# EAGLE design IOExpander (EAGLE 9.5.2)

## Sheet 1 of 2
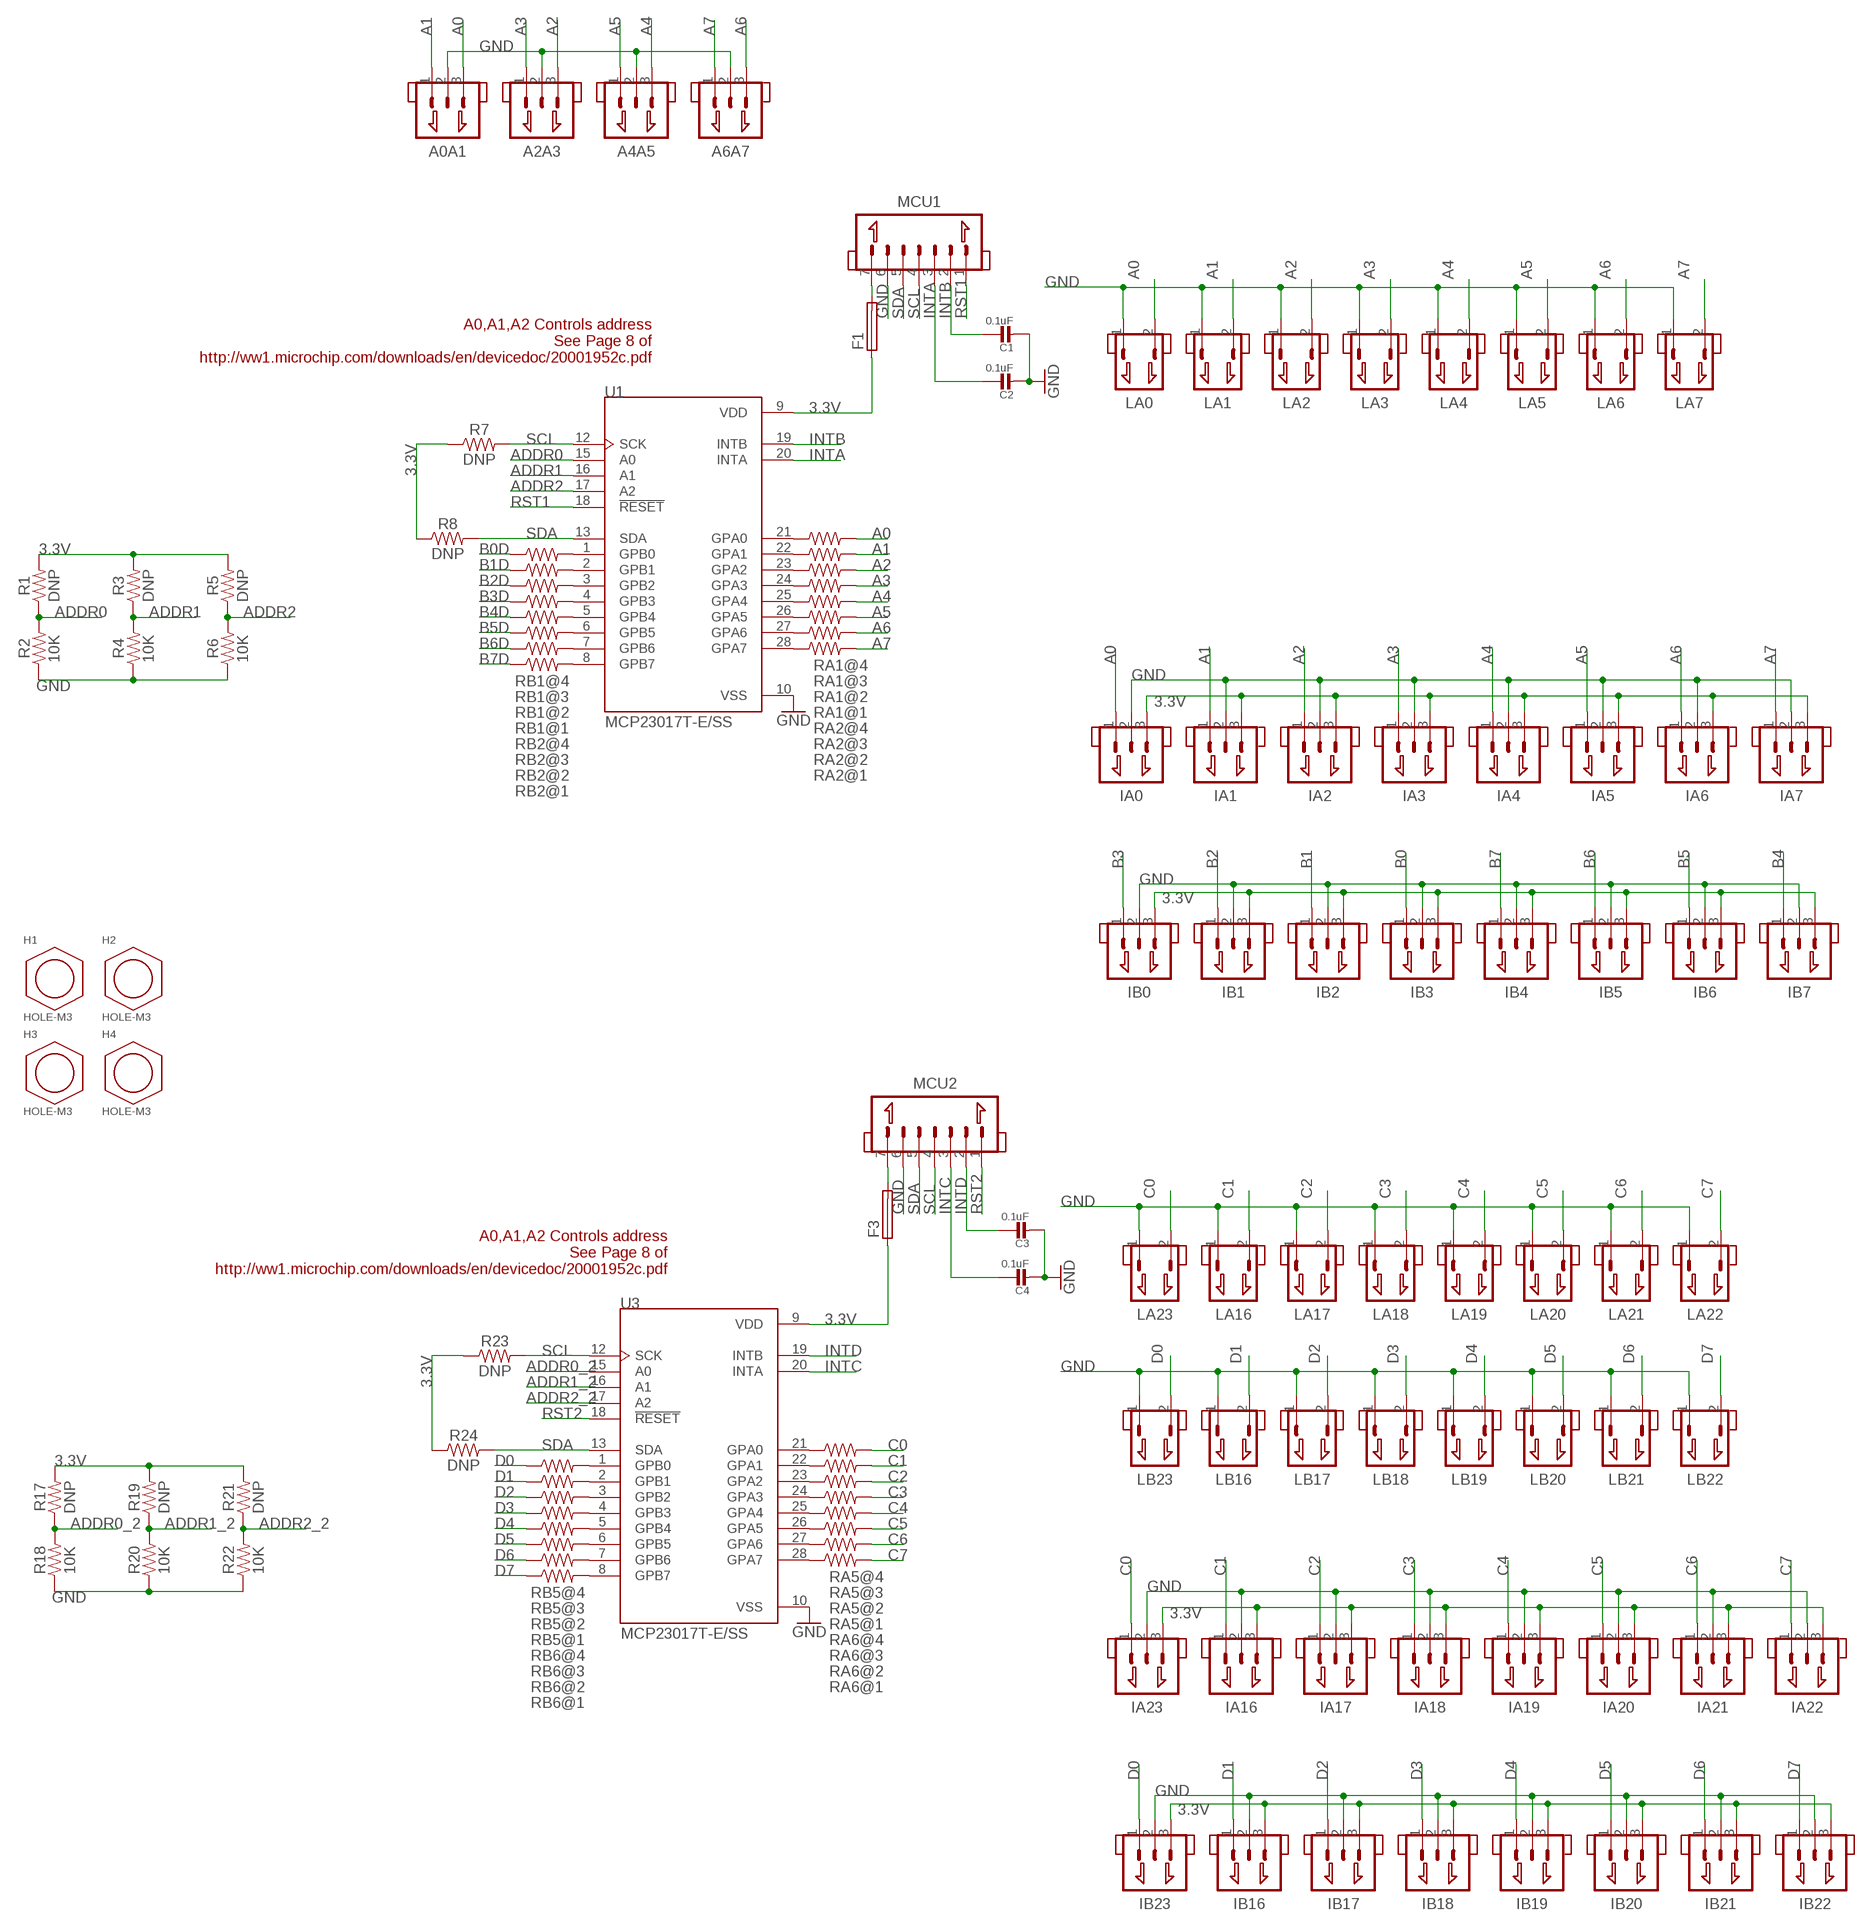
[diagram p0: schematic, sheet 1]

### Parts
A0A1  JST_1.25_3P  [JST1.25_3P]
A2A3  JST_1.25_3P  [JST1.25_3P]
A4A5  JST_1.25_3P  [JST1.25_3P]
A6A7  JST_1.25_3P  [JST1.25_3P]
C1  0.1uF  CAP_CERAMIC_0603  [0603]
C2  0.1uF  CAP_CERAMIC_0603  [0603]
C3  0.1uF  CAP_CERAMIC_0603  [0603]
C4  0.1uF  CAP_CERAMIC_0603  [0603]
F1  FUSE-0603  [0603]
F3  FUSE-0603  [0603]
H1  HOLE-M3  [M3]
H2  HOLE-M3  [M3]
H3  HOLE-M3  [M3]
H4  HOLE-M3  [M3]
IA0  JST_1.25_3P  [JST1.25_3P]
IA1  JST_1.25_3P  [JST1.25_3P]
IA2  JST_1.25_3P  [JST1.25_3P]
IA3  JST_1.25_3P  [JST1.25_3P]
IA4  JST_1.25_3P  [JST1.25_3P]
IA5  JST_1.25_3P  [JST1.25_3P]
IA6  JST_1.25_3P  [JST1.25_3P]
IA7  JST_1.25_3P  [JST1.25_3P]
IA16  JST_1.25_3P  [JST1.25_3P]
IA17  JST_1.25_3P  [JST1.25_3P]
IA18  JST_1.25_3P  [JST1.25_3P]
IA19  JST_1.25_3P  [JST1.25_3P]
IA20  JST_1.25_3P  [JST1.25_3P]
IA21  JST_1.25_3P  [JST1.25_3P]
IA22  JST_1.25_3P  [JST1.25_3P]
IA23  JST_1.25_3P  [JST1.25_3P]
IB0  JST_1.25_3P  [JST1.25_3P]
IB1  JST_1.25_3P  [JST1.25_3P]
IB2  JST_1.25_3P  [JST1.25_3P]
IB3  JST_1.25_3P  [JST1.25_3P]
IB4  JST_1.25_3P  [JST1.25_3P]
IB5  JST_1.25_3P  [JST1.25_3P]
IB6  JST_1.25_3P  [JST1.25_3P]
IB7  JST_1.25_3P  [JST1.25_3P]
IB16  JST_1.25_3P  [JST1.25_3P]
IB17  JST_1.25_3P  [JST1.25_3P]
IB18  JST_1.25_3P  [JST1.25_3P]
IB19  JST_1.25_3P  [JST1.25_3P]
IB20  JST_1.25_3P  [JST1.25_3P]
IB21  JST_1.25_3P  [JST1.25_3P]
IB22  JST_1.25_3P  [JST1.25_3P]
IB23  JST_1.25_3P  [JST1.25_3P]
LA0  JST_1.25_2P  [JST1.25_2P]
LA1  JST_1.25_2P  [JST1.25_2P]
LA2  JST_1.25_2P  [JST1.25_2P]
LA3  JST_1.25_2P  [JST1.25_2P]
LA4  JST_1.25_2P  [JST1.25_2P]
LA5  JST_1.25_2P  [JST1.25_2P]
LA6  JST_1.25_2P  [JST1.25_2P]
LA7  JST_1.25_2P  [JST1.25_2P]
LA16  JST_1.25_2P  [JST1.25_2P]
LA17  JST_1.25_2P  [JST1.25_2P]
LA18  JST_1.25_2P  [JST1.25_2P]
LA19  JST_1.25_2P  [JST1.25_2P]
LA20  JST_1.25_2P  [JST1.25_2P]
LA21  JST_1.25_2P  [JST1.25_2P]
LA22  JST_1.25_2P  [JST1.25_2P]
LA23  JST_1.25_2P  [JST1.25_2P]
LB16  JST_1.25_2P  [JST1.25_2P]
LB17  JST_1.25_2P  [JST1.25_2P]
LB18  JST_1.25_2P  [JST1.25_2P]
LB19  JST_1.25_2P  [JST1.25_2P]
LB20  JST_1.25_2P  [JST1.25_2P]
LB21  JST_1.25_2P  [JST1.25_2P]
LB22  JST_1.25_2P  [JST1.25_2P]
LB23  JST_1.25_2P  [JST1.25_2P]
MCU1  JST_1.25_7P  [JST1.25_7P]
MCU2  JST_1.25_7P  [JST1.25_7P]
R1  DNP  RESISTOR0603  [0603]
R2  10K  RESISTOR0603  [0603]
R3  DNP  RESISTOR0603  [0603]
R4  10K  RESISTOR0603  [0603]
R5  DNP  RESISTOR0603  [0603]
R6  10K  RESISTOR0603  [0603]
R7  DNP  RESISTOR0603  [0603]
R8  DNP  RESISTOR0603  [0603]
R17  DNP  RESISTOR0603  [0603]
R18  10K  RESISTOR0603  [0603]
R19  DNP  RESISTOR0603  [0603]
R20  10K  RESISTOR0603  [0603]
R21  DNP  RESISTOR0603  [0603]
R22  10K  RESISTOR0603  [0603]
R23  DNP  RESISTOR0603  [0603]
R24  DNP  RESISTOR0603  [0603]
RA1  RESISTOR_ARRAY_1206_SEPARATE  [RESCAF80P320X160X60-8N]
RA2  RESISTOR_ARRAY_1206_SEPARATE  [RESCAF80P320X160X60-8N]
RA5  RESISTOR_ARRAY_1206_SEPARATE  [RESCAF80P320X160X60-8N]
RA6  RESISTOR_ARRAY_1206_SEPARATE  [RESCAF80P320X160X60-8N]
RB1  RESISTOR_ARRAY_1206_SEPARATE_REVERSE  [RESCAF80P320X160X60-8N]
RB2  RESISTOR_ARRAY_1206_SEPARATE_REVERSE  [RESCAF80P320X160X60-8N]
RB5  RESISTOR_ARRAY_1206_SEPARATE_REVERSE  [RESCAF80P320X160X60-8N]
RB6  RESISTOR_ARRAY_1206_SEPARATE_REVERSE  [RESCAF80P320X160X60-8N]
U1  MCP23017T-E/SS  [SOP65P780X200-28N]
U3  MCP23017T-E/SS  [SOP65P780X200-28N]

### Nets
3.3V: F1.1 F3.1 IA0.3 IA1.3 IA2.3 IA3.3 IA4.3 IA5.3 IA6.3 IA7.3 IA16.3 IA17.3 IA18.3 IA19.3 IA20.3 IA21.3 IA22.3 IA23.3 IB0.3 IB1.3 IB2.3 IB3.3 IB4.3 IB5.3 IB6.3 IB7.3 IB16.3 IB17.3 IB18.3 IB19.3 IB20.3 IB21.3 IB22.3 IB23.3 R1.2 R3.2 R5.2 R7.1 R8.1 R17.2 R19.2 R21.2 R23.1 R24.1 U1.9(VDD) U3.9(VDD) ; also sheet 2
A0: A0A1.3 IA0.1 LA0.2 RA1.5
A1: A0A1.1 IA1.1 LA1.2 RA1.6
A2: A2A3.3 IA2.1 LA2.2 RA1.7
A3: A2A3.1 IA3.1 LA3.2 RA1.8
A4: A4A5.3 IA4.1 LA4.2 RA2.5
A5: A4A5.1 IA5.1 LA5.2 RA2.6
A6: A6A7.3 IA6.1 LA6.2 RA2.7
A7: A6A7.1 IA7.1 LA7.2 RA2.8
ADDR0: R1.1 R2.2 U1.15(A0)
ADDR0_2: R17.1 R18.2 U3.15(A0)
ADDR1: R3.1 R4.2 U1.16(A1)
ADDR1_2: R19.1 R20.2 U3.16(A1)
ADDR2: R5.1 R6.2 U1.17(A2)
ADDR2_2: R21.1 R22.2 U3.17(A2)
B0: IB3.1 ; also sheet 2
B0D: RB1.5 ; also sheet 2
B1: IB2.1 ; also sheet 2
B1D: RB1.6 ; also sheet 2
B2: IB1.1 ; also sheet 2
B2D: RB1.7 ; also sheet 2
B3: IB0.1 ; also sheet 2
B3D: RB1.8 ; also sheet 2
B4: IB7.1 ; also sheet 2
B4D: RB2.5 ; also sheet 2
B5: IB6.1 ; also sheet 2
B5D: RB2.6 ; also sheet 2
B6: IB5.1 ; also sheet 2
B6D: RB2.7 ; also sheet 2
B7: IB4.1 ; also sheet 2
B7D: RB2.8 ; also sheet 2
C0: IA23.1 LA23.2 RA5.5
C1: IA16.1 LA16.2 RA5.6
C2: IA17.1 LA17.2 RA5.7
C3: IA18.1 LA18.2 RA5.8
C4: IA19.1 LA19.2 RA6.5
C5: IA20.1 LA20.2 RA6.6
C6: IA21.1 LA21.2 RA6.7
C7: IA22.1 LA22.2 RA6.8
D0: IB23.1 LB23.2 RB5.5
D1: IB16.1 LB16.2 RB5.6
D2: IB17.1 LB17.2 RB5.7
D3: IB18.1 LB18.2 RB5.8
D4: IB19.1 LB19.2 RB6.5
D5: IB20.1 LB20.2 RB6.6
D6: IB21.1 LB21.2 RB6.7
D7: IB22.1 LB22.2 RB6.8
GND: A0A1.2 A2A3.2 A4A5.2 A6A7.2 C1.2 C2.2 C3.2 C4.2 IA0.2 IA1.2 IA2.2 IA3.2 IA4.2 IA5.2 IA6.2 IA7.2 IA16.2 IA17.2 IA18.2 IA19.2 IA20.2 IA21.2 IA22.2 IA23.2 IB0.2 IB1.2 IB2.2 IB3.2 IB4.2 IB5.2 IB6.2 IB7.2 IB16.2 IB17.2 IB18.2 IB19.2 IB20.2 IB21.2 IB22.2 IB23.2 LA0.1 LA1.1 LA2.1 LA3.1 LA4.1 LA5.1 LA6.1 LA7.1 LA16.1 LA17.1 LA18.1 LA19.1 LA20.1 LA21.1 LA22.1 LA23.1 LB16.1 LB17.1 LB18.1 LB19.1 LB20.1 LB21.1 LB22.1 LB23.1 MCU1.6 MCU2.6 R2.1 R4.1 R6.1 R18.1 R20.1 R22.1 U1.10(VSS) U3.10(VSS) ; supply symbol labelled SUPPLY_GND ; also sheet 2
INTA: C2.1 MCU1.3 U1.20(INTA)
INTB: C1.1 MCU1.2 U1.19(INTB)
INTC: C4.1 MCU2.3 U3.20(INTA)
INTD: C3.1 MCU2.2 U3.19(INTB)
N$1: RA1.1 U1.24(GPA3)
N$2: RA1.2 U1.23(GPA2)
N$3: RA1.3 U1.22(GPA1)
N$4: RA1.4 U1.21(GPA0)
N$5: RA2.1 U1.28(GPA7)
N$6: RA2.2 U1.27(GPA6)
N$7: RA2.3 U1.26(GPA5)
N$8: RA2.4 U1.25(GPA4)
N$9: F1.2 MCU1.7
N$10: RB1.1 U1.4(GPB3)
N$11: RB1.2 U1.3(GPB2)
N$12: RB1.3 U1.2(GPB1)
N$13: RB1.4 U1.1(GPB0)
N$14: RB2.1 U1.8(GPB7)
N$15: RB2.2 U1.7(GPB6)
N$16: RB2.3 U1.6(GPB5)
N$17: RB2.4 U1.5(GPB4)
N$18: F3.2 MCU2.7
N$35: RB5.1 U3.4(GPB3)
N$36: RB5.2 U3.3(GPB2)
N$37: RB5.3 U3.2(GPB1)
N$38: RB5.4 U3.1(GPB0)
N$39: RB6.1 U3.8(GPB7)
N$40: RB6.2 U3.7(GPB6)
N$41: RB6.3 U3.6(GPB5)
N$42: RB6.4 U3.5(GPB4)
N$43: RA5.1 U3.24(GPA3)
N$44: RA5.2 U3.23(GPA2)
N$45: RA5.3 U3.22(GPA1)
N$46: RA5.4 U3.21(GPA0)
N$47: RA6.1 U3.28(GPA7)
N$48: RA6.2 U3.27(GPA6)
N$49: RA6.3 U3.26(GPA5)
N$50: RA6.4 U3.25(GPA4)
RST1: MCU1.1 U1.18(!RESET)
RST2: MCU2.1 U3.18(!RESET)
SCL: MCU1.4 MCU2.4 R7.2 R23.2 U1.12(SCK) U3.12(SCK)
SDA: MCU1.5 MCU2.5 R8.2 R24.2 U1.13(SDA) U3.13(SDA)

### Notes on the sheet
- A0,A1,A2 Controls address
  See Page 8 of
  http://ww1.microchip.com/downloads/en/devicedoc/20001952c.pdf
- A0,A1,A2 Controls address
  See Page 8 of
  http://ww1.microchip.com/downloads/en/devicedoc/20001952c.pdf

## Sheet 2 of 2
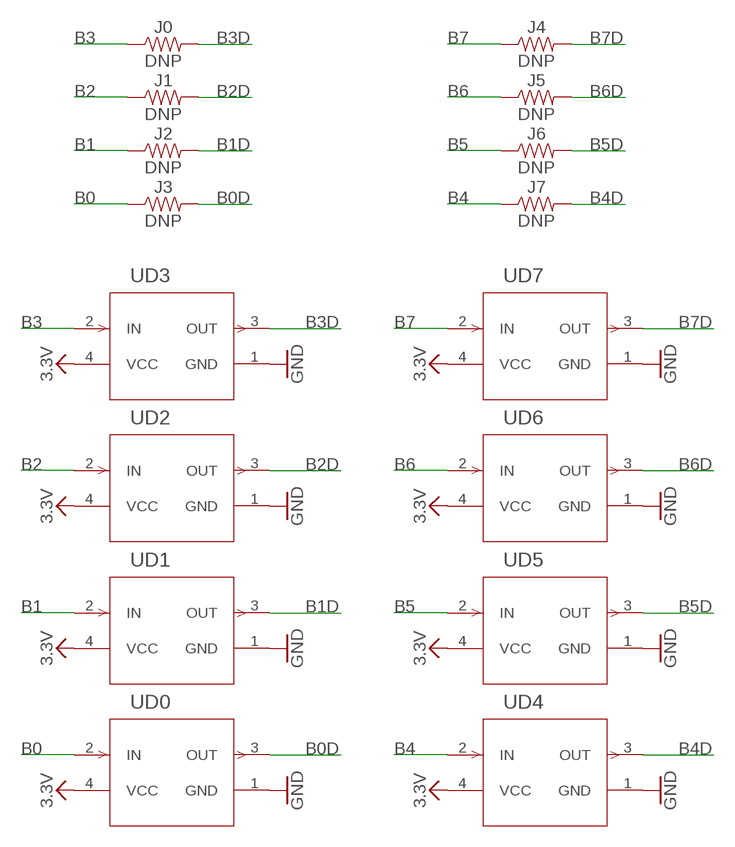
[diagram p1: schematic, sheet 2]

### Parts
J0  DNP  RESISTOR0603  [0603]
J1  DNP  RESISTOR0603  [0603]
J2  DNP  RESISTOR0603  [0603]
J3  DNP  RESISTOR0603  [0603]
J4  DNP  RESISTOR0603  [0603]
J5  DNP  RESISTOR0603  [0603]
J6  DNP  RESISTOR0603  [0603]
J7  DNP  RESISTOR0603  [0603]
UD0  DEBOUNCE_MAX6816EUS+T  [21-0052F]
UD1  DEBOUNCE_MAX6816EUS+T  [21-0052F]
UD2  DEBOUNCE_MAX6816EUS+T  [21-0052F]
UD3  DEBOUNCE_MAX6816EUS+T  [21-0052F]
UD4  DEBOUNCE_MAX6816EUS+T  [21-0052F]
UD5  DEBOUNCE_MAX6816EUS+T  [21-0052F]
UD6  DEBOUNCE_MAX6816EUS+T  [21-0052F]
UD7  DEBOUNCE_MAX6816EUS+T  [21-0052F]

### Nets
3.3V: UD0.4(VCC) UD1.4(VCC) UD2.4(VCC) UD3.4(VCC) UD4.4(VCC) UD5.4(VCC) UD6.4(VCC) UD7.4(VCC) ; supply symbol labelled SUPPLY_3.3V ; also sheet 1
B0: J3.1 UD0.2(IN) ; also sheet 1
B0D: J3.2 UD0.3(OUT) ; also sheet 1
B1: J2.1 UD1.2(IN) ; also sheet 1
B1D: J2.2 UD1.3(OUT) ; also sheet 1
B2: J1.1 UD2.2(IN) ; also sheet 1
B2D: J1.2 UD2.3(OUT) ; also sheet 1
B3: J0.1 UD3.2(IN) ; also sheet 1
B3D: J0.2 UD3.3(OUT) ; also sheet 1
B4: J7.1 UD4.2(IN) ; also sheet 1
B4D: J7.2 UD4.3(OUT) ; also sheet 1
B5: J6.1 UD5.2(IN) ; also sheet 1
B5D: J6.2 UD5.3(OUT) ; also sheet 1
B6: J5.1 UD6.2(IN) ; also sheet 1
B6D: J5.2 UD6.3(OUT) ; also sheet 1
B7: J4.1 UD7.2(IN) ; also sheet 1
B7D: J4.2 UD7.3(OUT) ; also sheet 1
GND: UD0.1(GND) UD1.1(GND) UD2.1(GND) UD3.1(GND) UD4.1(GND) UD5.1(GND) UD6.1(GND) UD7.1(GND) ; supply symbol labelled SUPPLY_GND ; also sheet 1

## Library data of the parts
A0A1 A2A3 A4A5 A6A7 IA0 IA1-IA7 IA16-IA23 IB0 IB1-IB7 IB16-IB23 = Scott-Connectors:JST_1.25_3P
C1-C4 = Scott-Electrical:CAP_CERAMIC
F1 F3 = Scott-Electrical:FUSE
H1-H4 = Scott-Mechanical:HOLE
J0 J1-J7 R1-R8 R17-R24 = Scott-Electrical:RESISTOR: Generic Resistor Package
LA0 LA1-LA7 LA16-LA23 LB16-LB23 = Scott-Connectors:JST_1.25_2P
MCU1 MCU2 = Scott-Connectors:JST_1.25_7P
RA1 RA2 RA5 RA6 RB1 RB2 RB5 RB6 = Scott-Electrical:RESISTOR_ARRAY_1206_SEPARATE
U1 U3 = Scott-ICs:MCP23017T-E/SS: 16-bit Input/Output Expander, I2C interface, Pb-free28 SSOP .209in T/R; AVAILABILITY: Unavailable; DESCRIPTION: I/O Expander 16 I²C 1.7MHz 28-SSOP; MF: Microchip; MP: MCP23017T-E/SS; PACKAGE: SSOP-28 Microchip; PRICE: None
UD0 UD1-UD7 = Scott-ICs:DEBOUNCE_MAX6816EUS+T; BUILT_BY: EMA_UL_Team; MANUFACTURER_PART_NUMBER: MAX6816EUS+T; VENDOR: Maxim Integrated Products

## Board
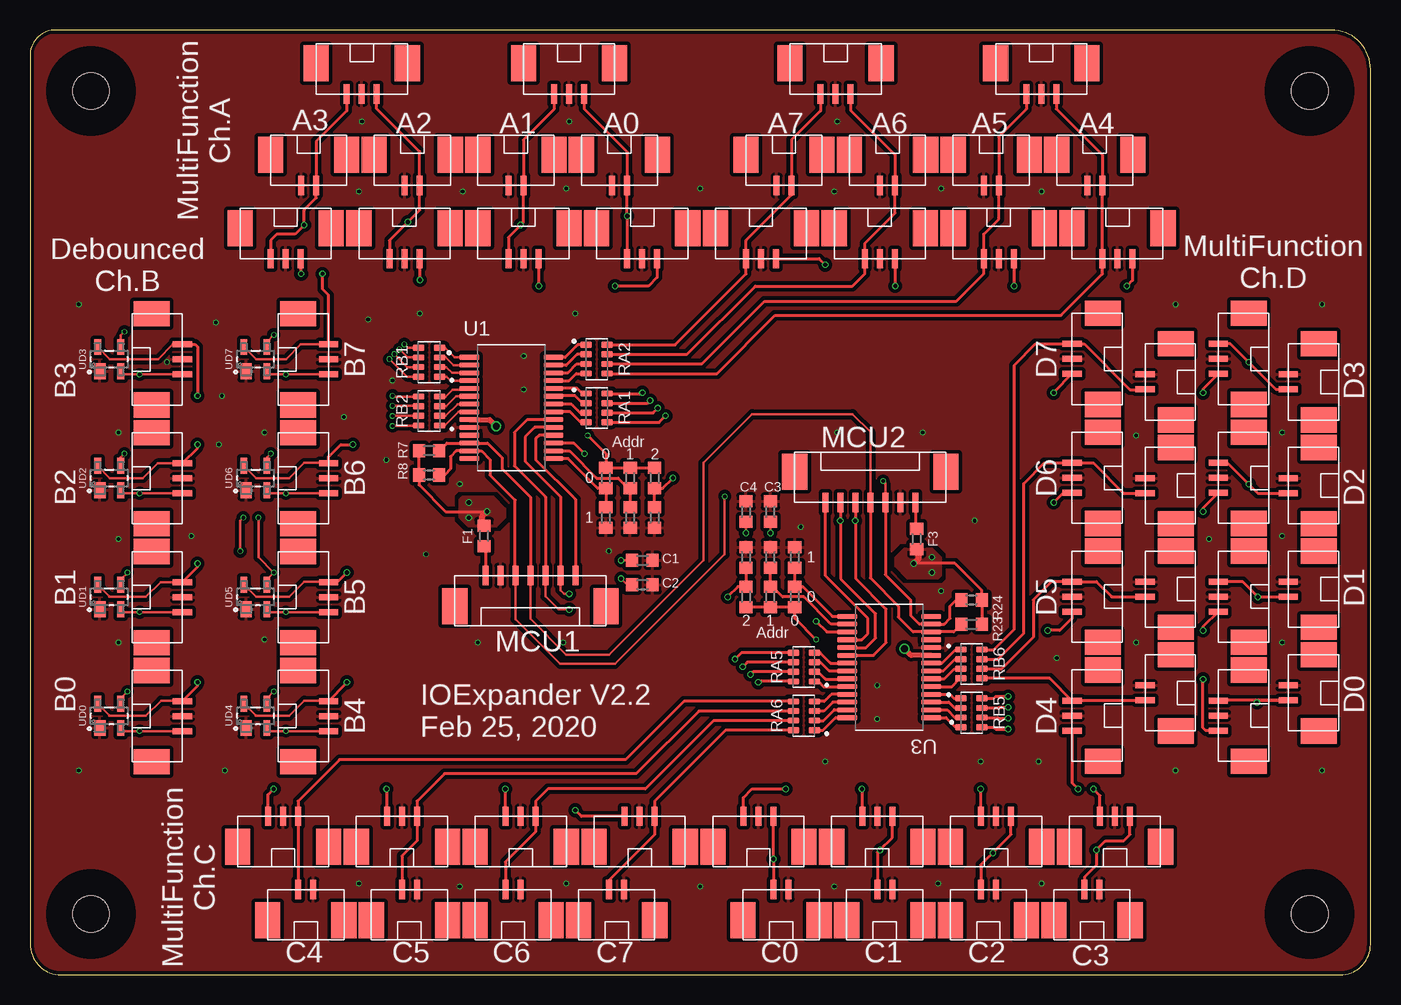
[diagram p2: board, top side]
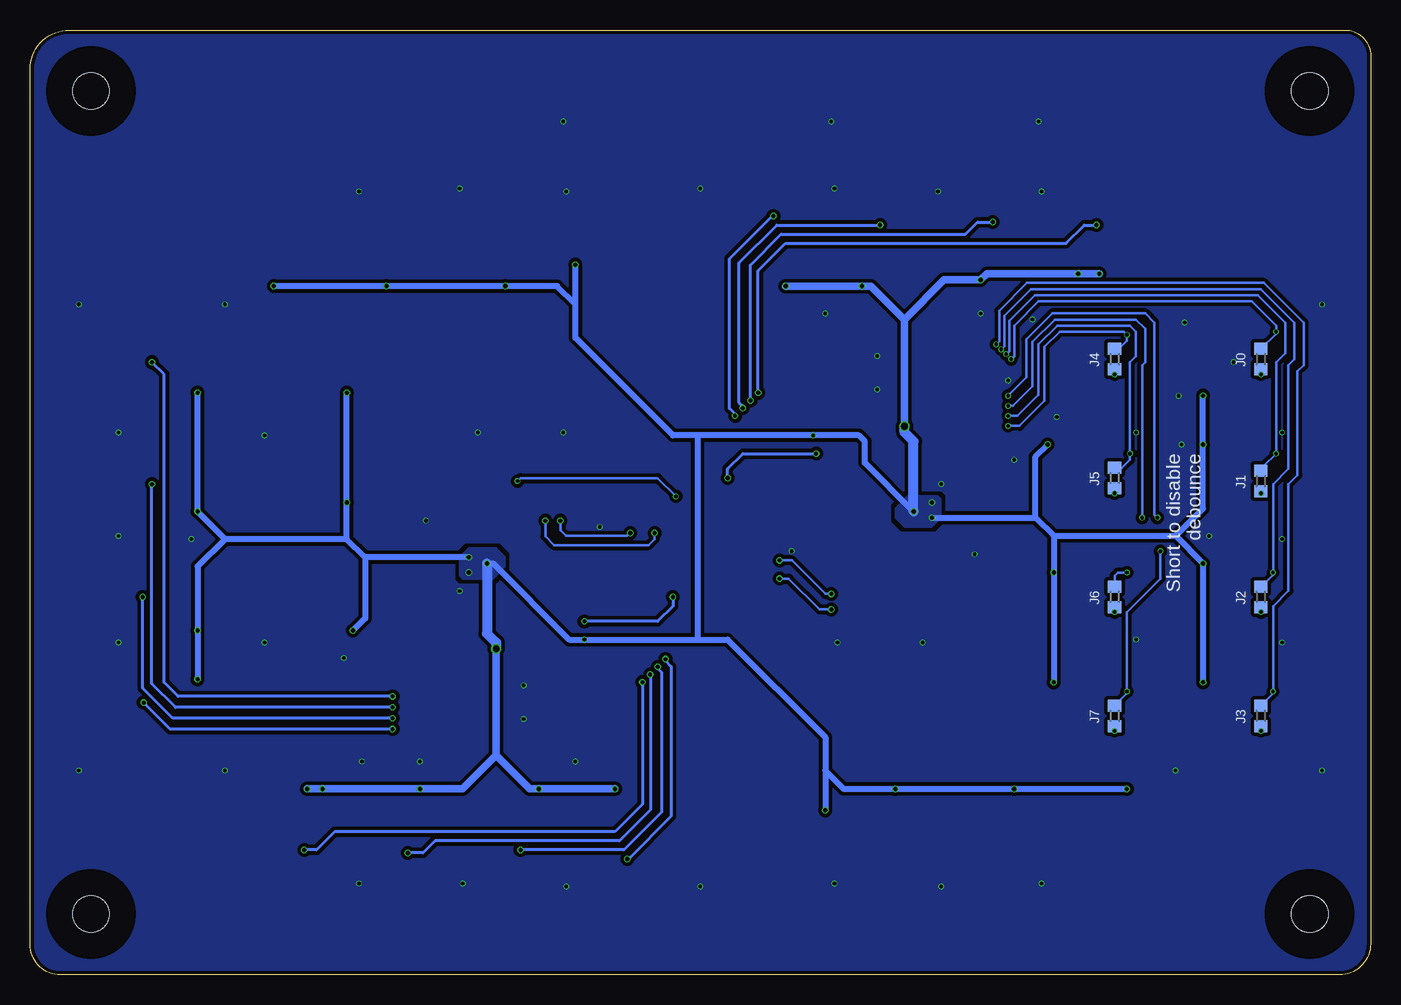
[diagram p3: board, bottom side, seen from below]

Size 111.76 x 78.74 mm. Coordinates in mm from the lower left corner, seen from the top.
Outline: 0,76.59 0,2.6 arc90 2.6,0 109.22,0 arc90 111.76,2.54 111.76,75.46 arc90 108.48,78.74 2.15,78.74 arc90 0,76.59
Copper layers (1*16): Top 0.035559375mm / dielectric 1.6mm / Bottom 0.035559375mm
Design rules "jlcpcb2layer *": minimum track width 5mil, minimum drill 12mil, track to track 5mil, track to pad 5mil, pad to pad 5mil, via to via 5mil, smd to smd 5mil, copper to edge 8mil, drill to drill 6mil, minimum pad ring 5mil, minimum via ring 3mil, stop-mask expansion 2.5mil, vias tented up to drill 22mil, thermal gap 10mil

### Footprints (pad centres in the part's own frame; a part is rotated, then mirrored left to right if it is on the bottom)
JST1.25_3P = smd 0.5 x 1.6: 1 0,0; 2 1.25,0; 3 2.5,0 | smd 2.1 x 3: 4 -2.55,2.55; 5 5.05,2.55
0603 = smd 1 x 1.1: 1 -0.85,0; 2 0.85,0
M3 = hole 3.048: 0,0
JST1.25_2P = smd 0.5 x 1.6: 1 0,0; 2 1.25,0 | smd 2.1 x 3: 3 -2.55,2.55; 4 3.8,2.55
JST1.25_7P = smd 0.5 x 1.6: 1 0,0; 2 1.25,0; 3 2.5,0; 4 3.75,0; 5 5,0; 6 6.25,0; 7 7.5,0 | smd 2.1 x 3: 8 -2.55,2.55; 9 10.05,2.55
RESCAF80P320X160X60-8N = smd 0.97 x 0.53: 1 -0.875,1.2; 2 -0.875,0.4; 3 -0.875,-0.4; 4 -0.875,-1.2; 5 0.875,-1.2; 6 0.875,-0.4; 7 0.875,0.4; 8 0.875,1.2
SOP65P780X200-28N = smd 1.651 x 0.432: 1 -3.505,4.225; 2 -3.505,3.575; 3 -3.505,2.925; 4 -3.505,2.275; 5 -3.505,1.625; 6 -3.505,0.975; 7 -3.505,0.325; 8 -3.505,-0.325; 9 -3.505,-0.975; 10 -3.505,-1.625; 11 -3.505,-2.275; 12 -3.505,-2.925; 13 -3.505,-3.575; 14 -3.505,-4.225; 15 3.505,-4.225; 16 3.505,-3.575; 17 3.505,-2.925; 18 3.505,-2.275; 19 3.505,-1.625; 20 3.505,-0.975; 21 3.505,-0.325; 22 3.505,0.325; 23 3.505,0.975; 24 3.505,1.625; 25 3.505,2.275; 26 3.505,2.925; 27 3.505,3.575; 28 3.505,4.225
21-0052F = smd 0.94 x 1.321: 1 -0.775,-1.016 | smd 0.559 x 1.321: 2 0.965,-1.016; 3 0.965,1.016; 4 -0.965,1.016

### Placement (x,y rotation side)
A0A1  43.69,73.41 0 top
A2A3  26.42,73.41 0 top
A4A5  83.06,73.41 0 top
A6A7  65.91,73.41 0 top
C1  51.05,34.54 0 top
C2  51.05,32.51 0 top
C3  61.72,38.61 90 top
C4  59.69,38.61 90 top
F1  37.85,36.58 270 top
F3  73.91,36.32 90 top
H1  5.08,5.08 0 top
H2  106.68,73.66 0 top
H3  106.68,5.08 0 top
H4  5.08,73.66 0 top
IA0  49.78,59.69 0 top
IA1  39.88,59.69 0 top
IA2  29.97,59.69 0 top
IA3  20.07,59.69 0 top
IA4  89.41,59.69 0 top
IA5  79.5,59.69 0 top
IA6  69.6,59.69 0 top
IA7  59.69,59.69 0 top
IA16  71.88,13.21 180 top
IA17  81.79,13.21 180 top
IA18  91.69,13.21 180 top
IA19  22.35,13.21 180 top
IA20  32.26,13.21 180 top
IA21  42.16,13.21 180 top
IA22  52.07,13.21 180 top
IA23  61.98,13.21 180 top
IB0  12.7,50.04 90 top
IB1  12.7,40.13 90 top
IB2  12.7,30.23 90 top
IB3  12.7,20.32 90 top
IB4  24.89,50.04 90 top
IB5  24.89,40.13 90 top
IB6  24.89,30.23 90 top
IB7  24.89,20.32 90 top
IB16  99.06,32.77 270 top
IB17  99.06,42.67 270 top
IB18  99.06,52.58 270 top
IB19  86.87,22.86 270 top
IB20  86.87,32.77 270 top
IB21  86.87,42.67 270 top
IB22  86.87,52.58 270 top
IB23  99.06,22.86 270 top
J0  9.14,51.31 90 bottom
J1  9.14,41.15 90 bottom
J2  9.14,31.5 90 bottom
J3  9.14,21.59 90 bottom
J4  21.34,51.31 90 bottom
J5  21.34,41.4 90 bottom
J6  21.34,31.5 90 bottom
J7  21.34,21.59 90 bottom
LA0  48.51,65.79 0 top
LA1  39.88,65.79 0 top
LA2  31.24,65.79 0 top
LA3  22.61,65.79 0 top
LA4  88.14,65.79 0 top
LA5  79.5,65.79 0 top
LA6  70.87,65.79 0 top
LA7  62.23,65.79 0 top
LA16  71.88,7.11 180 top
LA17  80.52,7.11 180 top
LA18  89.15,7.11 180 top
LA19  23.62,7.11 180 top
LA20  32.26,7.11 180 top
LA21  40.89,7.11 180 top
LA22  49.53,7.11 180 top
LA23  63.25,7.11 180 top
LB16  104.9,32.77 270 top
LB17  104.9,41.4 270 top
LB18  104.9,50.04 270 top
LB19  92.96,24.13 270 top
LB20  92.96,32.77 270 top
LB21  92.96,41.4 270 top
LB22  92.96,50.04 270 top
LB23  104.9,24.13 270 top
MCU1  45.47,33.27 180 top
MCU2  66.29,39.37 0 top
R1  48.01,41.4 90 top
R2  48.01,38.1 90 top
R3  50.04,41.4 90 top
R4  50.04,38.1 90 top
R5  52.07,41.4 90 top
R6  52.07,38.1 90 top
R7  33.27,43.69 0 top
R8  33.27,41.66 0 top
R17  63.75,31.5 270 top
R18  63.75,34.8 270 top
R19  61.72,31.5 270 top
R20  61.72,34.8 270 top
R21  59.69,31.5 270 top
R22  59.69,34.8 270 top
R23  78.49,29.21 180 top
R24  78.49,31.24 180 top
RA1  47.24,47.24 0 top
RA2  47.24,51.31 0 top
RA5  64.52,25.65 180 top
RA6  64.52,21.59 180 top
RB1  33.27,51.05 180 top
RB2  33.27,46.99 180 top
RB5  78.49,21.84 0 top
RB6  78.49,25.91 0 top
U1  40.13,47.24 0 top
U3  71.63,25.65 180 top
UD0  6.6,21.59 0 top
UD1  6.6,31.5 0 top
UD2  6.6,41.4 0 top
UD3  6.6,51.31 0 top
UD4  18.8,21.59 0 top
UD5  18.8,31.5 0 top
UD6  18.8,41.4 0 top
UD7  18.8,51.31 0 top

### Tracks (layer width: path | path; a pad name or v marks a point on that pad's centre or on a via)
3.3V  (via drill 0.3, 0.35, 0.55)
  Top 0.203: UD3.4 6.66,51.31 10.67,51.31 11.9,52.54 IB0.3 | IB1.3 10.63,42.63 9.4,41.4 6.66,41.4 UD2.4 | UD1.4 6.6,31.55 6.6,31.5 9.65,31.5 10.88,32.73 IB2.3 | UD0.4 6.6,21.64 6.6,21.59 9.65,21.59 10.92,22.86 12.66,22.86 IB3.3 | UD4.4 18.8,21.64 18.8,21.59 21.59,21.59 22.86,22.86 24.85,22.86 IB7.3 | UD5.4 18.85,31.5 21.59,31.5 22.86,32.77 24.85,32.77 IB6.3 | UD6.4 18.85,41.4 21.59,41.4 22.86,42.67 24.85,42.67 IB5.3 | UD7.4 18.85,51.31 21.34,51.31 22.57,52.54 IB4.3
  Top 0.254: R7.1 R8.1 32.42,40.83 34.64,38.61 v38.1,38.61 | v46.48,44.96 48.01,43.43 R1.2 R3.2 R5.2 | IA7.3 65.79,59.69 v66.29,59.18 | IA6.3 72.1,57.44 v72.14,57.4 | IA5.3 82,57.44 v82.04,57.4 | IA4.3 91.91,57.87 v91.44,57.4 | IA3.3 22.57,58.46 v22.61,58.42 | IA2.3 32.47,57.95 v32.51,57.91 | IA1.3 42.38,57.44 v42.42,57.4 | IA0.3 52.28,58.13 51.56,57.4 v48.77,57.4 | IB0.3 13.76,52.54 13.97,52.32 v13.97,48.26 | IB1.3 13.97,43.9 v13.97,44.2 | IB2.3 13.97,34 v13.97,34.29 | IB3.3 13.97,24.09 v13.97,24.38 | IB7.3 26.42,24.34 v26.42,24.38 | IB6.3 25.61,32.73 v26.42,33.53 | IB5.3 24.89,43.18 25.91,44.2 v26.92,44.2 | IB4.3 24.89,56.64 24.38,57.15 v24.38,58.42 | R23.1 R24.1 79.34,32.07 77.12,34.29 v73.66,34.29 | R21.2 R19.2 R17.2 63.75,29.72 v65.53,27.94 | IA22.3 45.97,13.21 v45.47,13.72 | IA21.3 39.66,15.45 v39.62,15.49 | IA20.3 29.76,15.45 v29.72,15.49 | IA19.3 19.85,15.03 v20.32,15.49 | IA18.3 89.19,14.95 v88.65,15.49 | IA17.3 79.29,15.45 v79.25,15.49 | IA16.3 69.38,15.45 v69.34,15.49 | IA23.3 59.48,14.77 60.2,15.49 v62.99,15.49 | IB23.3 98,20.36 97.79,20.57 v97.79,24.64 | IB16.3 97.79,29 v97.79,28.7 | IB17.3 97.79,38.9 v97.79,38.61 | IB18.3 97.79,48.81 v97.79,48.51 | IB22.3 85.34,48.55 v85.34,48.51 | IB21.3 86.15,40.17 v85.34,39.37 | IB20.3 86.87,29.72 85.85,28.7 v84.84,28.7 | IB19.3 86.87,16 v87.38,15.49
  Top 0.406: U1.9 38.31,46.27 v38.86,45.72 | U3.9 73.45,26.63 v72.9,27.18
  Top 0.508: v38.1,38.61 37.69,38.2 37.69,37.58 F1.1 | v73.66,34.29 74.07,34.7 74.07,35.32 F3.1
  Bottom 0.508: v38.1,38.61 42.16,42.67 42.16,44.45 42.67,44.96 v46.48,44.96 56.13,44.96 | v36.58,38.1 27.94,38.1 | 26.42,36.58 16.26,36.58 | 27.94,38.1 26.42,36.58 | 56.13,44.96 58.17,44.96 66.29,53.09 66.29,55.88 | 66.29,55.88 67.82,57.4 v72.14,57.4 v82.04,57.4 v91.44,57.4 | 66.29,55.88 v66.29,59.18 | 16.26,36.58 13.97,38.86 v13.97,44.2 v13.97,48.26 | 16.26,36.58 v13.97,34.29 v13.97,24.38 | 27.94,38.1 27.94,43.18 v26.92,44.2 | 26.42,36.58 v26.42,33.53 v26.42,24.38 | v75.18,34.8 83.82,34.8 | 85.34,36.32 95.5,36.32 | 83.82,34.8 85.34,36.32 | v73.66,34.29 73.15,34.29 66.8,27.94 v65.53,27.94 56.13,27.94 | 56.13,27.94 53.59,27.94 45.47,19.81 45.47,17.02 | 45.47,17.02 43.94,15.49 v39.62,15.49 v29.72,15.49 v20.32,15.49 | 45.47,17.02 v45.47,13.72 | 95.5,36.32 97.79,34.04 v97.79,28.7 v97.79,24.64 | 95.5,36.32 v97.79,38.61 v97.79,48.51 | 83.82,34.8 83.82,29.72 v84.84,28.7 | 85.34,36.32 v85.34,39.37 v85.34,48.51 | 56.13,44.96 56.13,27.94
  Bottom 0.61: v38.86,45.72 38.86,54.61 | v22.61,58.42 v24.38,58.42 32,58.42 v32.51,57.91 35.56,57.91 38.86,54.61 | 38.86,54.61 41.66,57.4 v42.42,57.4 v48.77,57.4 | v72.9,27.18 72.9,18.29 | v88.65,15.49 v87.38,15.49 v79.25,15.49 75.69,15.49 72.9,18.29 | 72.9,18.29 70.1,15.49 v69.34,15.49 v62.99,15.49
  Bottom 0.813: v38.1,38.61 38.1,44.45 38.86,45.21 v38.86,45.72 | v73.66,34.29 73.66,28.45 72.9,27.69 v72.9,27.18
  other vias: 36.58,39.37 75.18,33.53
  pour Top (isolate 0.305): 36.07,39.88 38.61,39.88 39.62,38.86 39.62,38.1 38.86,37.34 36.58,37.34 35.81,38.1 35.81,39.62
  pour Bottom (isolate 0.305): 36.07,39.88 38.61,39.88 39.62,38.86 39.62,38.1 38.86,37.34 36.58,37.34 35.81,38.1 35.81,39.62
  pour Top (isolate 0.305): 75.69,33.02 73.15,33.02 72.14,34.04 72.14,34.8 72.9,35.56 75.18,35.56 75.95,34.8 75.95,33.27
  pour Bottom (isolate 0.305): 75.69,33.02 73.15,33.02 72.14,34.04 72.14,34.8 72.9,35.56 75.18,35.56 75.95,34.8 75.95,33.27
A0  (via drill 0.35)
  Top 0.254: v52.98,46.59 52.44,46.04 RA1.5 | IA0.1 v49.78,63.25 49.76,63.27 LA0.2 49.76,68.6 46.19,72.18 A0A1.3
  Bottom 0.254: v52.98,46.59 52.98,46.74 53.45,47.21 53.45,59.67 49.88,63.25 v49.78,63.25
A1  (via drill 0.35)
  Top 0.254: v52.34,47.23 51.95,46.84 RA1.6 | IA1.1 39.88,61.47 v40.89,62.48 41.13,62.72 LA1.2 41.13,69.58 43.69,72.14 A0A1.1
  Bottom 0.254: v52.34,47.23 52.34,47.38 52.65,47.7 52.65,59.34 49.51,62.48 v40.89,62.48
A2  (via drill 0.35)
  Top 0.254: v51.7,47.87 51.47,47.64 RA1.7 | IA2.1 29.97,61.21 v31.5,62.74 32.49,63.73 LA2.2 32.49,68.6 28.92,72.18 A2A3.3
  Bottom 0.254: v51.7,47.87 51.7,48.02 51.71,48.04 51.71,59.15 49.14,61.72 33.78,61.72 32.77,62.74 v31.5,62.74
A3  (via drill 0.35)
  Top 0.254: v51.05,48.51 50.98,48.44 RA1.8 | IA3.1 20.07,61.21 20.57,61.72 22.1,61.72 v22.86,62.48 22.86,63.75 23.86,64.75 LA3.2 23.86,69.45 26.42,72.01 A2A3.1
  Bottom 0.254: v51.05,48.51 51.05,58.67 48.77,60.96 25.4,60.96 23.88,62.48 v22.86,62.48
A4
  Top 0.254: RA2.5 57.25,50.11 62.11,54.97 85.95,54.97 89.41,58.42 IA4.1 89.41,65.77 LA4.2 89.39,68.35 85.56,72.18 A4A5.3
A5
  Top 0.254: RA2.6 56.01,50.91 61.23,56.13 77.22,56.13 79.5,58.42 IA5.1 79.5,61.72 80.75,62.97 LA5.2 80.75,69.83 83.06,72.14 A4A5.1
A6
  Top 0.254: RA2.7 54.77,51.71 60.46,57.4 68.58,57.4 69.6,58.42 IA6.1 69.6,60.96 72.12,63.48 LA6.2 72.12,68.35 68.41,72.05 A6A7.3
A7
  Top 0.254: RA2.8 53.78,52.51 59.69,58.42 IA7.1 59.69,61.21 63.48,65 LA7.2 63.48,69.58 65.91,72.01 A6A7.1
ADDR0
  Top 0.254: R2.2 R1.1 47.33,40.55 44.87,43.02 U1.15
ADDR0_2
  Top 0.254: R18.2 R17.1 64.43,32.35 66.89,29.88 U3.15
ADDR1
  Top 0.254: R3.1 50.04,40.39 | 50.04,40.39 R4.2 | U1.16 44.98,43.67 47.24,41.4 49.02,41.4 50.04,40.39
ADDR1_2
  Top 0.254: R19.1 61.72,32.51 | 61.72,32.51 R20.2 | U3.16 66.78,29.23 64.52,31.5 62.74,31.5 61.72,32.51
ADDR2  (via drill 0.35)
  Top 0.254: R6.2 R5.1 52.74,40.55 v53.59,41.4 | v46.23,43.43 45.34,44.32 U1.17
  Bottom 0.254: v53.59,41.4 53.59,42.16 52.32,43.43 v46.23,43.43
ADDR2_2  (via drill 0.35)
  Top 0.254: R22.2 R21.1 59.02,32.35 v58.17,31.5 | v65.53,29.46 66.42,28.58 U3.17
  Bottom 0.254: v58.17,31.5 58.17,30.73 59.44,29.46 v65.53,29.46
B0  (via drill 0.3)
  Top 0.203: IB3.1 v9.14,20.32 7.82,20.32 UD0.2
  Bottom 0.203: J3.1 v9.14,20.32
B0D  (via drill 0.3)
  Top 0.203: v8.13,23.62 7.57,23.06 UD0.3 | v31.21,52.55 31.5,52.25 RB1.5
  Bottom 0.203: v31.21,52.55 30.96,52.8 30.96,55.34 28.64,57.66 8.89,57.66 5.59,54.36 5.59,50.8 6.1,50.29 6.1,41.66 6.86,40.89 6.86,32 8.13,30.73 v8.13,23.62 8.13,23.46 J3.2
B1  (via drill 0.3)
  Top 0.203: IB2.1 v9.14,30.23 7.82,30.23 UD1.2
  Bottom 0.203: v9.14,30.23 J2.1
B1D  (via drill 0.3)
  Top 0.203: v8.13,33.53 7.57,32.97 UD1.3 | v30.8,52.13 31.48,51.45 RB1.6
  Bottom 0.203: v30.8,52.13 30.54,52.39 30.54,54.93 28.32,57.15 9.14,57.15 6.35,54.36 6.35,51.31 6.86,50.8 6.86,42.16 8.13,40.89 v8.13,33.53 8.13,33.36 J2.2
B2  (via drill 0.3)
  Top 0.203: IB1.1 v9.14,40.13 7.82,40.13 UD2.2
  Bottom 0.203: J1.1 v9.14,40.13
B2D  (via drill 0.3)
  Top 0.203: v7.87,43.43 7.57,43.13 UD2.3 | v30.39,51.72 31.45,50.65 RB1.7
  Bottom 0.203: v30.39,51.72 30.13,51.98 30.13,54.52 28,56.64 9.4,56.64 7.11,54.36 7.11,51.82 7.87,51.05 v7.87,43.43 8.89,42.42 8.89,42.25 J1.2
B3  (via drill 0.3)
  Top 0.203: 12.68,50.02 12.66,50.04 v9.14,50.04 7.82,50.04 UD3.2
  Top 0.254: 12.68,50.02 IB0.1
  Bottom 0.203: v9.14,50.04 J0.1
B3D  (via drill 0.3)
  Top 0.203: v7.87,53.59 7.57,53.29 UD3.3 | v29.97,51.31 31.43,49.85 RB1.8
  Bottom 0.203: v29.97,51.31 29.72,51.56 29.72,54.1 27.69,56.13 9.91,56.13 7.87,54.1 v7.87,53.59 7.87,53.43 J0.2
B4  (via drill 0.3)
  Top 0.203: IB7.1 v21.34,20.32 20.02,20.32 UD4.2
  Bottom 0.203: J7.1 v21.34,20.32
B4D  (via drill 0.3)
  Top 0.203: UD4.3 19.76,23.06 v20.32,23.62 | v17.53,35.31 17.53,37.85 v17.78,38.1 | v30.23,48.26 30.3,48.19 RB2.5
  Bottom 0.203: v17.53,35.31 17.53,33.02 20.32,30.23 v20.32,23.62 20.32,23.46 J7.2 | v17.78,38.1 18.03,38.35 18.03,54.36 18.8,55.12 26.54,55.12 28.7,52.95 28.7,49.78 v30.23,48.26
B5  (via drill 0.3)
  Top 0.203: IB6.1 v21.34,30.23 20.07,30.23 19.81,30.48 UD5.2
  Bottom 0.203: J6.1 v21.34,30.23
B5D  (via drill 0.3)
  Top 0.203: UD5.3 19.76,32.97 v20.32,33.53 19.05,34.8 v19.05,38.1 | v30.23,47.42 32.37,47.42 RB2.6
  Bottom 0.203: v20.32,33.53 21.08,33.53 21.34,33.27 J6.2 | v19.05,38.1 19.05,50.8 18.8,51.05 18.8,53.85 19.56,54.61 26.33,54.61 28.19,52.74 28.19,49.07 29.84,47.42 v30.23,47.42
B6  (via drill 0.3)
  Top 0.203: IB5.1 v21.34,40.13 20.07,40.13 19.81,40.39 UD6.2
  Bottom 0.203: J5.1 v21.34,40.13
B6D  (via drill 0.3)
  Top 0.203: UD6.3 19.76,43.13 v20.07,43.43 | v30.23,46.58 RB2.7
  Bottom 0.203: v30.23,46.58 29.45,46.58 27.69,48.35 27.69,52.53 26.12,54.1 20.07,54.1 19.56,53.59 19.56,51.56 20.07,51.05 v20.07,43.43 20.07,42.93 20.74,42.25 J5.2
B7  (via drill 0.3)
  Top 0.203: UD7.2 19.81,50.29 20.07,50.04 v21.34,50.04 IB4.1
  Bottom 0.203: J4.1 v21.34,50.04
B7D  (via drill 0.3)
  Top 0.203: UD7.3 19.76,52.78 v20.32,53.34 | RB2.8 32.35,45.74 v30.23,45.74
  Bottom 0.203: v30.23,45.74 29.27,45.74 27.18,47.84 27.18,52.32 25.91,53.59 20.57,53.59 v20.32,53.34 20.32,52.83 20.99,52.16 J4.2
C0  (via drill 0.35)
  Top 0.254: v58.78,26.31 59.32,26.85 RA5.5 | LA23.2 62,9.63 v61.98,9.65 IA23.1
  Bottom 0.254: v58.78,26.31 58.78,26.16 58.31,25.69 58.31,13.23 61.88,9.65 v61.98,9.65
C1  (via drill 0.35)
  Top 0.254: v59.42,25.67 59.81,26.05 RA5.6 | LA16.2 70.63,10.18 v70.87,10.41 71.88,11.43 IA16.1
  Bottom 0.254: v59.42,25.67 59.42,25.52 59.11,25.2 59.11,13.56 62.25,10.41 v70.87,10.41
C2  (via drill 0.35)
  Top 0.254: v60.06,25.03 60.29,25.25 RA5.7 | IA17.1 81.79,11.68 v80.26,10.16 79.27,9.16 LA17.2
  Bottom 0.254: v60.06,25.03 60.06,24.87 60.05,24.86 60.05,13.75 62.62,11.18 77.98,11.18 78.99,10.16 v80.26,10.16
C3  (via drill 0.35)
  Top 0.254: v60.71,24.38 60.78,24.45 RA5.8 | LA18.2 87.9,8.15 88.9,9.14 v88.9,10.41 89.66,11.18 91.19,11.18 91.69,11.68 IA18.1
  Bottom 0.254: v60.71,24.38 60.71,14.22 62.99,11.94 86.36,11.94 87.88,10.41 v88.9,10.41
C4
  Top 0.254: RA6.5 54.51,22.79 49.65,17.93 25.81,17.93 22.35,14.48 IA19.1 22.35,7.13 LA19.2
C5
  Top 0.254: RA6.6 55.75,21.99 50.53,16.76 34.54,16.76 32.26,14.48 IA20.1 32.26,11.18 31.01,9.93 LA20.2
C6
  Top 0.254: RA6.7 56.99,21.19 51.3,15.49 43.18,15.49 42.16,14.48 IA21.1 42.16,11.94 39.64,9.42 LA21.2
C7
  Top 0.254: RA6.8 57.98,20.39 52.07,14.48 IA22.1 52.07,11.68 48.28,7.89 LA22.2
D0  (via drill 0.35)
  Top 0.254: RB5.5 80.35,20.64 80.52,20.48 v81.53,20.48 | v102.28,22.69 102.47,22.88 LB23.2 99.08,22.88 IB23.1
  Bottom 0.254: v81.53,20.48 100.08,20.48 v102.28,22.69
D1  (via drill 0.35)
  Top 0.254: RB5.6 80.69,21.44 80.74,21.39 v81.53,21.39 | IB16.1 101.09,32.77 v102.36,31.5 102.38,31.52 LB16.2
  Bottom 0.254: v81.53,21.39 99.85,21.39 102.36,23.9 v102.36,31.5
D2  (via drill 0.35)
  Top 0.254: RB5.7 80.69,22.24 80.74,22.3 v81.53,22.3 | IB17.1 99.82,42.67 v101.6,40.89 102.34,40.15 LB17.2
  Bottom 0.254: v81.53,22.3 99.63,22.3 101.6,24.27 v101.6,40.89
D3  (via drill 0.35)
  Top 0.254: RB5.8 80.35,23.04 80.52,23.21 v81.53,23.21 | LB18.2 103.87,48.79 v101.6,51.05 100.08,52.58 IB18.1
  Bottom 0.254: v81.53,23.21 99.41,23.21 100.58,24.38 100.58,50.04 v101.6,51.05
D4
  Top 0.254: RB6.5 85.02,24.71 IB19.1 86.89,22.88 LB19.2
D5
  Top 0.254: RB6.6 81.02,25.51 83.64,28.13 83.64,31.24 85.17,32.77 IB20.1 88.9,32.77 90.17,31.5 92.94,31.5 LB20.2
D6
  Top 0.254: RB6.7 80.69,26.31 82.84,28.46 82.84,40.93 84.58,42.67 IB21.1 88.65,42.67 91.17,40.15 LB21.2
D7
  Top 0.254: RB6.8 80.35,27.11 82.04,28.8 82.04,50.8 83.82,52.58 IB22.1 87.88,52.58 91.69,48.77 92.94,48.77 LB22.2
GND  (via drill 0.3)
  other vias: 35.81,40.89 7.37,45.21 7.37,36.32 7.37,27.69 13.46,36.58 19.56,45.21 4.06,55.88 19.56,27.94 16.26,17.02 4.06,17.02 26.16,46.48 27.43,65.28 36.07,65.28 44.7,65.53 55.88,65.53 67.06,65.28 75.95,65.53 84.33,65.28 37.34,27.69 44.45,27.69 33.02,35.05 48.26,35.31 41.15,48.77 41.15,51.56 45.47,55.12 32.51,55.12 75.95,32 104.39,27.69 104.39,36.58 104.39,45.21 98.3,36.32 92.2,27.69 95.5,17.02 107.7,17.02 92.2,44.96 95.5,55.88 107.7,55.88 85.6,26.42 84.07,17.78 84.33,7.62 75.69,7.62 67.06,7.37 55.88,7.37 44.7,7.62 35.81,7.37 27.43,7.62 74.42,45.21 67.31,45.21 78.74,37.85 64.26,37.34 70.61,24.13 70.61,21.34 66.29,17.78 79.25,17.78 27.69,71.12 44.96,71.12 67.31,71.12 11.43,51.05 16,48.26 15.75,44.2 15.49,54.36 28.19,54.61 30.23,49.53 29.72,42.93
  pour Top (isolate 0.305, rank 6): -1.02,79.76 114.55,79.76 114.55,-1.78 -1.02,-1.78
  pour Bottom (isolate 0.305, rank 6): -1.02,79.76 -1.02,-1.52 114.55,-1.52 114.55,79.76
INTA  (via drill 0.35)
  Top 0.203: MCU1.3 42.97,31.55 44.07,30.45 v44.96,30.45 | C2.1 49.78,32.51 v49.28,33.02
  Top 0.254: U1.20 41.44,46.27 40.39,45.21 40.39,42.42 42.97,39.84 MCU1.3
  Bottom 0.203: v49.28,33.02 48.51,33.02 45.94,30.45 v44.96,30.45
INTB  (via drill 0.35)
  Top 0.203: MCU1.2 44.22,32.07 44.53,31.75 v44.96,31.75 | v49.28,34.54 C1.1
  Top 0.254: U1.19 42.06,45.62 41.27,44.83 41.27,42.8 44.22,39.86 MCU1.2
  Bottom 0.203: v44.96,31.75 45.47,31.75 48.26,34.54 v49.28,34.54
INTC  (via drill 0.35)
  Top 0.203: MCU2.3 v68.79,37.85 | v59.69,36.83 C4.1
  Top 0.254: U3.20 70.32,26.63 71.37,27.69 71.37,30.48 68.81,33.04 68.81,39.35 MCU2.3
  Bottom 0.203: v68.79,37.85 68.79,36.55 68.06,35.81 60.2,35.81 59.69,36.32 v59.69,36.83
INTD  (via drill 0.35)
  Top 0.203: MCU2.2 v67.54,37.85 | v61.72,36.83 C3.1
  Top 0.254: U3.19 69.7,27.28 70.48,28.07 70.48,30.1 67.56,33.02 67.56,39.35 MCU2.2
  Bottom 0.203: v67.54,37.85 67.54,37.06 67.06,36.58 61.98,36.58 v61.72,36.83
N$1
  Top 0.254: RA1.1 46.04,48.44 45.62,48.87 U1.24
N$2
  Top 0.254: RA1.2 46.06,47.64 45.45,48.26 43.68,48.26 U1.23
N$3
  Top 0.254: RA1.3 45.87,46.84 45.14,47.57 U1.22
N$4
  Top 0.254: RA1.4 45.9,46.04 45.03,46.92 U1.21
N$5
  Top 0.254: RA2.1 45.65,52.51 44.61,51.47 U1.28
N$6
  Top 0.254: RA2.2 45.61,51.71 44.7,50.8 43.66,50.8 U1.27
N$7
  Top 0.254: U1.26 44.84,50.17 45.57,50.91 RA2.3
N$8
  Top 0.254: U1.25 44.96,49.53 45.54,50.11 RA2.4
N$9
  Top 0.254: F1.2 37.97,35.61 MCU1.7
N$10
  Top 0.203: RB1.1 34.73,49.85 35.06,49.52 U1.4
N$11
  Top 0.203: U1.3 35.17,50.17 34.69,50.65 RB1.2
N$12
  Top 0.203: RB1.3 34.65,51.45 35.31,50.8 36.61,50.8 U1.2
N$13
  Top 0.203: U1.1 35.4,51.47 34.61,52.25 RB1.4
N$14
  Top 0.203: U1.8 35.74,46.92 34.61,45.79 RB2.1
N$15
  Top 0.203: U1.7 35.63,47.57 34.65,46.59 RB2.2
N$16
  Top 0.203: RB2.3 34.69,47.39 35.52,48.22 U1.6
N$17
  Top 0.203: U1.5 36.53,48.77 35.23,48.77 34.66,48.19 RB2.4
N$18
  Top 0.254: MCU2.7 73.79,37.29 F3.2
N$35
  Top 0.254: U3.4 76.7,23.38 77.03,23.04 RB5.1
N$36
  Top 0.254: U3.3 76.58,22.73 77.07,22.24 RB5.2
N$37
  Top 0.254: U3.2 76.47,22.08 77.11,21.44 RB5.3
N$38
  Top 0.254: U3.1 76.36,21.43 77.15,20.64 RB5.4
N$39
  Top 0.254: U3.8 76.02,25.98 77.15,27.11 RB6.1
N$40
  Top 0.254: U3.7 76.13,25.33 77.11,26.31 RB6.2
N$41
  Top 0.254: U3.6 76.24,24.68 77.07,25.51 RB6.3
N$42
  Top 0.254: U3.5 76.86,24.03 77.54,24.71 RB6.4
N$43
  Top 0.254: RA5.1 65.72,24.45 66.14,24.03 U3.24
N$44
  Top 0.254: RA5.2 65.7,25.25 66.31,24.64 68.08,24.64 U3.23
N$45
  Top 0.254: RA5.3 65.89,26.05 66.62,25.33 U3.22
N$46
  Top 0.254: RA5.4 65.86,26.85 66.73,25.98 U3.21
N$47
  Top 0.254: RA6.1 66.11,20.39 67.15,21.43 U3.28
N$48
  Top 0.254: RA6.2 66.15,21.19 67.06,22.1 68.1,22.1 U3.27
N$49
  Top 0.254: U3.26 66.92,22.73 66.19,21.99 RA6.3
N$50
  Top 0.254: U3.25 68.11,23.37 66.8,23.37 66.22,22.79 RA6.4
RST1
  Top 0.254: U1.18 43.63,44.96 42.42,44.96 42.16,44.7 42.16,42.93 45.47,39.62 MCU1.1
RST2
  Top 0.254: U3.18 68.13,27.94 69.34,27.94 69.85,28.45 69.85,29.72 66.29,33.27 MCU2.1
SCL
  Top 0.203: MCU1.4 41.72,29.66 44.7,26.67 48.26,26.67 56.13,34.54 56.13,42.67 60.2,46.74 68.58,46.74 70.04,45.27 MCU2.4
  Top 0.254: R7.2 34.76,44.32 U1.12 38.14,44.32 39.37,43.09 39.37,42.16 41.72,39.82 MCU1.4 | R23.2 77,28.58 U3.12 73.62,28.58 72.39,29.81 72.39,30.73 70.04,33.08 MCU2.4
SDA  (via drill 0.3)
  Top 0.203: MCU1.5 40.47,29.64 44.2,25.91 48.77,25.91 57.91,35.05 v57.91,39.88 | v71.12,41.15 71.29,40.97 71.29,39.12
  Top 0.254: R8.2 34.54,41.66 35.05,42.16 35.05,43.18 35.54,43.67 U1.13 37.63,43.67 38.35,42.95 38.35,41.66 40.45,39.56 40.45,33.29 MCU1.5 | R24.2 77.22,31.24 76.71,30.73 76.71,29.72 76.22,29.23 U3.13 74.13,29.23 73.41,29.95 73.41,31.24 71.29,33.35 71.29,39.12 MCU2.5
  Bottom 0.203: v57.91,39.88 59.44,41.4 70.87,41.4 v71.12,41.15

### Text on the board
tPlace: MultiFunction / Ch.A | A3 | A2 | A1 | A0 | A7 | A6 | A5 | A4 | Debounced / Ch.B | MultiFunction / Ch.D | B7 | D7 | B3 | D3 | Addr | 0 | 1 | 2 | B2 | B6 | 0 | D6 | D2 | 1 | 1 | B1 | D1 | B5 | 0 | D5 | 2 | 1 | 0 | Addr | B0 | D0 | B4 | D4 | IOExpander V2.2 / Feb 25, 2020 | MultiFunction / Ch.C | C4 | C5 | C6 | C7 | C0 | C1 | C2 | C3
bPlace: Short to disable / debounce